# EAGLE design Esquematico (EAGLE 7.7.0)

## Sheet 1 of 2
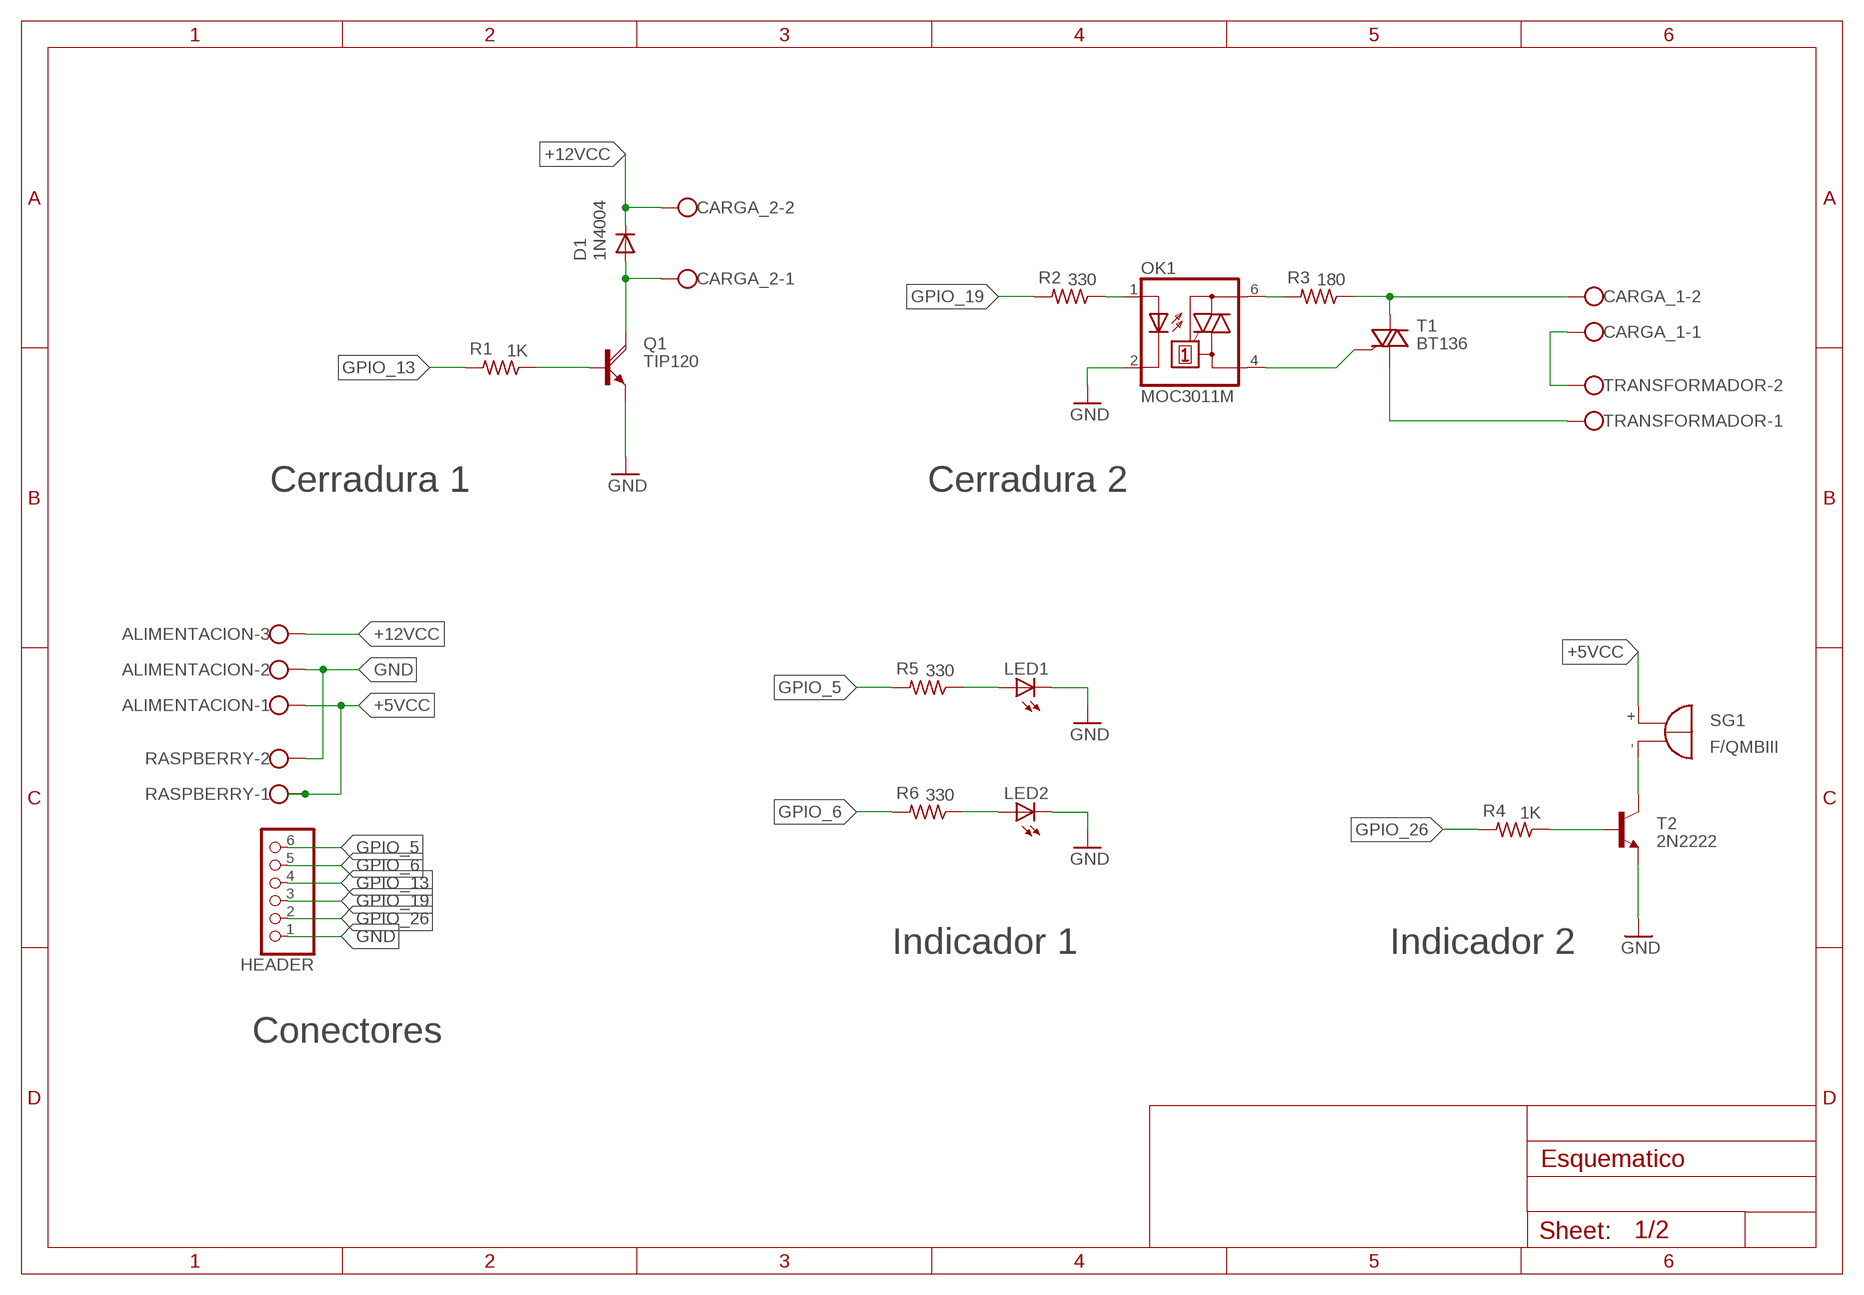
[diagram p0: schematic, sheet 1]

### Parts
ALIMENTACION  W237-103  [W237-103]
CARGA_1  W237-102  [W237-102]
CARGA_2  W237-102  [W237-102]
D1  1N4004  [DO41-10]
HEADER  PINHD-1X6B  [1X06-BIG]
LED1  LED5MM  [LED5MM]
LED2  LED5MM  [LED5MM]
OK1  MOC3011M  [DIL06]
Q1  TIP120  [TO220AH]
R1  1K  R-US_0207/10  [0207/10]
R2  330  R-US_0207/10  [0207/10]
R3  180  R-US_0207/10  [0207/10]
R4  1K  R-US_0207/10  [0207/10]
R5  330  R-US_0207/10  [0207/10]
R6  330  R-US_0207/10  [0207/10]
RASPBERRY  W237-102  [W237-102]
SG1  F/QMBIII  [F/QMBIII]
T1  BT136  [TO220AB]
T2  2N2222  [TO92-EBC-OVAL]
TRANSFORMADOR  W237-102  [W237-102]

### Nets
+5VCC: ALIMENTACION.1 RASPBERRY.1 SG1.+(-)
+12VCC: ALIMENTACION.3 CARGA_2.2 D1.C
CARGA_2: CARGA_2.1 D1.A Q1.C
GND: ALIMENTACION.2 HEADER.1 LED1.K(C) LED2.K(C) OK1.2(C) Q1.E RASPBERRY.2 T2.E
GPIO_5: HEADER.6 R5.2
GPIO_6: HEADER.5 R6.2
GPIO_13: HEADER.4 R1.2
GPIO_19: HEADER.3 R2.2
GPIO_26: HEADER.2 R4.2
N$1: LED1.A R5.1
N$2: Q1.B R1.1
N$3: SG1.-(+) T2.C
N$4: OK1.1(A) R2.1
N$5: OK1.6(A2) R3.2
N$6: CARGA_1.2 R3.1 T1.2(A2)
N$7: OK1.4(A1) T1.3(G)
N$8: LED2.A R6.1
N$11: CARGA_1.1 TRANSFORMADOR.2
N$12: T1.1(A1) TRANSFORMADOR.1
N$14: R4.1 T2.B

### Notes on the sheet
- Cerradura 1 | Cerradura 2
- Indicador 1 | Indicador 2
- Conectores

## Sheet 2 of 2
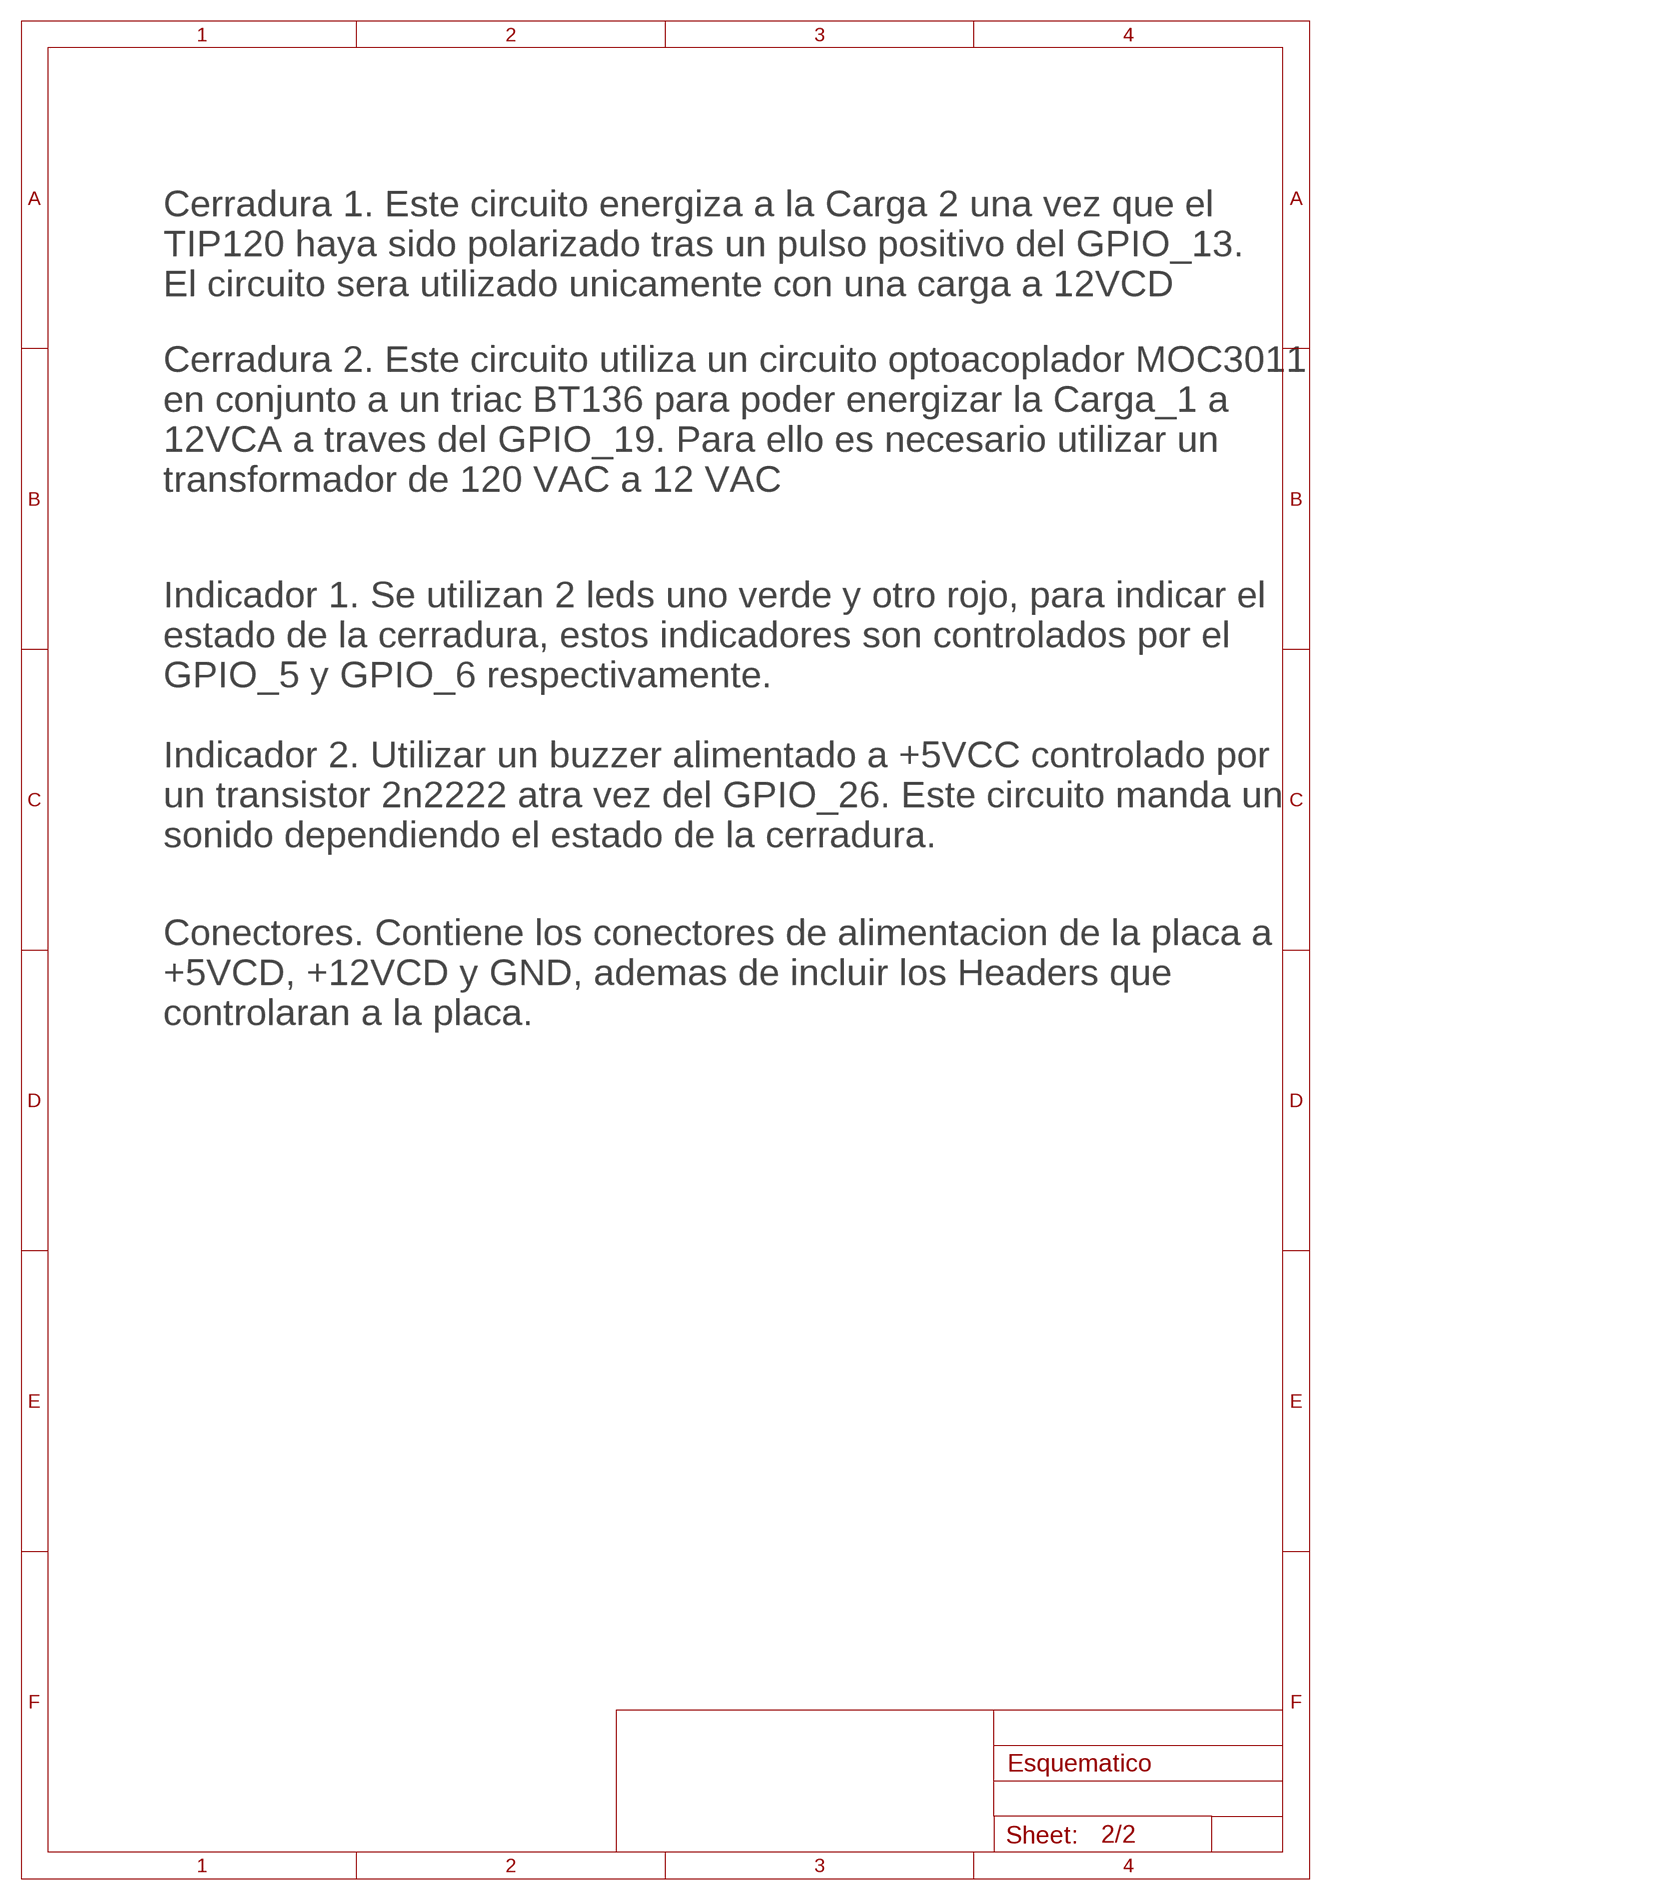
[diagram p1: schematic, sheet 2]

### Notes on the sheet
- Cerradura 1. Este circuito energiza a la Carga 2 una vez que el 
  TIP120 haya sido polarizado tras un pulso positivo del GPIO_13.
  El circuito sera utilizado unicamente con una carga a 12VCD
- Cerradura 2. Este circuito utiliza un circuito optoacoplador MOC3011 
  en conjunto a un triac BT136 para poder energizar la Carga_1 a
  12VCA a traves del GPIO_19. Para ello es necesario utilizar un 
  transformador de 120 VAC a 12 VAC
- Indicador 1. Se utilizan 2 leds uno verde y otro rojo, para indicar el 
  estado de la cerradura, estos indicadores son controlados por el 
  GPIO_5 y GPIO_6 respectivamente.
- Indicador 2. Utilizar un buzzer alimentado a +5VCC controlado por
  un transistor 2n2222 atra vez del GPIO_26. Este circuito manda un
  sonido dependiendo el estado de la cerradura.
- Conectores. Contiene los conectores de alimentacion de la placa a 
  +5VCD, +12VCD y GND, ademas de incluir los Headers que
  controlaran a la placa.

## Library data of the parts
ALIMENTACION = con-wago-500:W237-103: WAGO SCREW CLAMP; MPN: 237-103; OC_FARNELL: unknown; OC_NEWARK: 18M7116
CARGA_1 CARGA_2 RASPBERRY TRANSFORMADOR = con-wago-500:W237-102: WAGO SCREW CLAMP; MPN: 237-102; OC_FARNELL: unknown; OC_NEWARK: 70K9898
D1 = diode:1N4004: DIODE general purpose rectifier, 1 A
HEADER = adafruit:PINHD-1X6: PIN HEADER
LED1 LED2 = adafruit:LED: LED OSRAM: - CHIPLED LG R971, LG N971, LY N971, LG Q971, LY Q971, LO R971, LY R971 LH N974, LH R974 LS Q976, LO Q976, LY Q976 LO Q996 - Hyper CHIPLED LW Q18S LB Q993, LB Q99A, LB R99A - SideLED LS A670, LO A670, LY A670, LG A670, LP A670 LB A673, LV A673, LT A673, LW A673 LH A674 LY A675 LS A676, LA A676, LO A676, LY A676, LW A676 LS A679, LY A679, LG A679 - Hyper Micro SIDELED® LS Y876, LA Y876, LO Y876, LY Y876 LT Y87S - SmartLED LW L88C, LW L88S LB L89C, LB L89S, LG L890 LS L89K, LO L89K, LY L89K LS L896, LA L896, LO L896, LY L896 - TOPLED LS T670, LO T670, LY T670, LG T670, LP T670 LSG T670, LSP T670, LSY T670, LOP T670, LYG T670 LG T671, LOG T671, LSG T671 LB T673, LV T673, LT T673, LW T673 LH T674 LS T676, LA T676, LO T676, LY T676, LB T676, LH T676, LSB T676, LW T676 LB T67C, LV T67C, LT T67C, LS T67K, LO T67K, LY T67K, LW E67C LS E67B, LA E67B, LO E67B, LY E67B, LB E67C, LV E67C, LT E67C LW T67C LS T679, LY T679, LG T679 LS T770, LO T770, LY T770, LG T770, LP T770 LB T773, LV T773, LT T773, LW T773 LH T774 LS E675, LA E675, LY E675, LS T675 LS T776, LA T776, LO T776, LY T776, LB T776 LHGB T686 LT T68C, LB T68C - Hyper Mini TOPLED® LB M676 - Mini TOPLED Santana® LG M470 LS M47K, LO M47K, LY M47K Source: http://www.osram.convergy.de/
OK1 = optocoupler:MOC30*M: RANDOM-PHASE OPTOISOLATORS TRIAC DRIVER OUTPUT Source: http://www.fairchildsemi.com MOC3020-M.pdf; MF: FAIRCHILD SEMICONDUCTOR; MPN: MOC3011-M; OC_FARNELL: 1021363; OC_NEWARK: 72K8893
Q1 = transistor-power:TIP120: NPN DARLINGTON TRANSISTOR
R1-R6 = rcl:R-US_: RESISTOR, American symbol
SG1 = buzzer:F/QMBIII: BUZZER Source: Buerklin; OC_FARNELL: unknown; OC_NEWARK: unknown
T1 = Triacs:BT136: Triac BT136 series E sensitive gate Source: http://www.nxp.com/acrobat_download/datasheets/BT136_SERIES_E_2.pdf
T2 = adafruit:2N2222: NPN TRANSISTOR Big oval pads

## Board
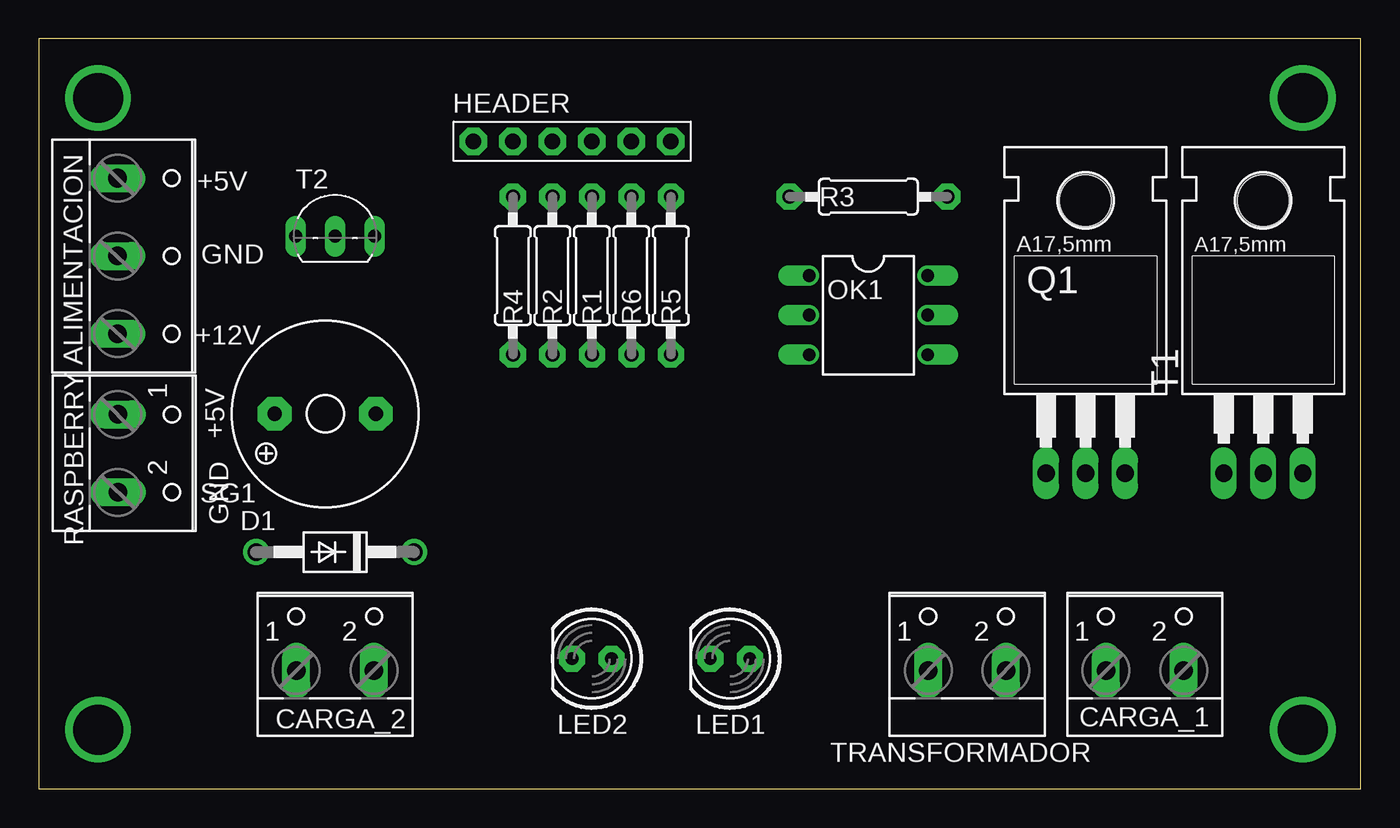
[diagram p2: board, top side]
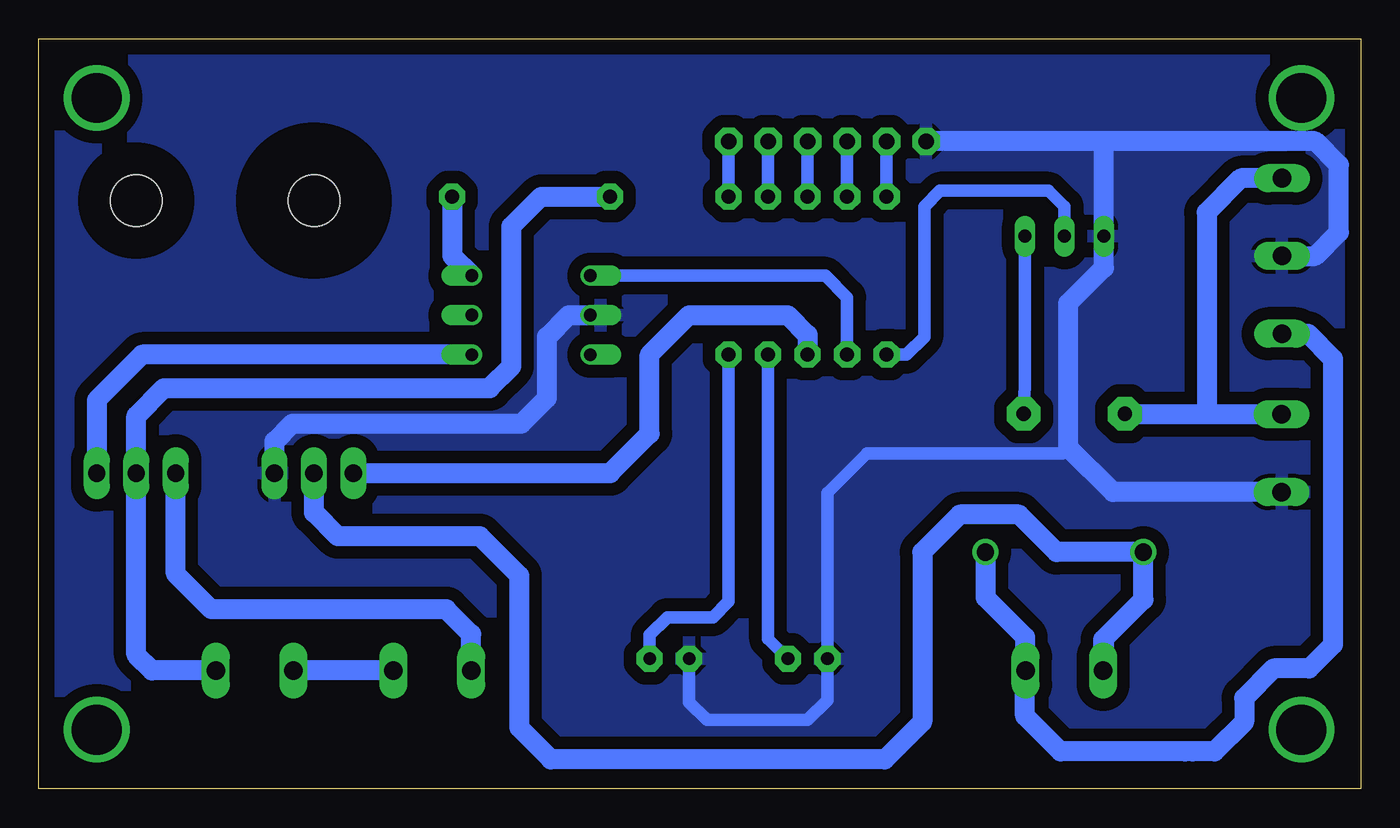
[diagram p3: board, bottom side, seen from below]

Size 85 x 48.25 mm. Coordinates in mm from the lower left corner, seen from the top.
Outline: 0,0 85,0 85,48.25 0,48.25 0,0
Copper layers (1*16): Top 0.035mm / dielectric 1.5mm / Bottom 0.035mm
Design rules "default": minimum track width 10mil, minimum drill 24mil, track to track 8mil, track to pad 8mil, pad to pad 8mil, via to via 8mil, smd to smd 8mil, copper to edge 40mil, drill to drill 8mil, minimum pad ring 10mil, minimum via ring 8mil, stop-mask expansion 4mil, vias tented up to drill 0mil, thermal gap 10mil

### Footprints (pad centres in the part's own frame; a part is rotated, then mirrored left to right if it is on the bottom)
W237-103 = drill 1.194 long: 1 -5,-1.29; 2 0,-1.29; 3 5,-1.29
W237-102 = drill 1.194 long: 1 -2.5,-1.27; 2 2.5,-1.27
DO41-10 = drill 1.118: A 5.08,0; C -5.08,0
1X06-BIG = drill 1.016 pad 1.778 octagon: 1 -6.35,0; 2 -3.81,0; 3 -1.27,0; 4 1.27,0; 5 3.81,0; 6 6.35,0
LED5MM = drill 0.813 pad 1.676 octagon: A -1.27,0; K 1.27,0
DIL06 = drill 0.813 offset: 1 -2.54,-3.81; 2 0,-3.81; 3 2.54,-3.81; 4 2.54,3.81; 5 0,3.81; 6 -2.54,3.81
TO220AH = drill 1.118 long: B -2.54,-6.35; C 0,-6.35; E 2.54,-6.35 | hole 3.302: 0,11.176
0207/10 = drill 0.9 pad 1.676 octagon: 1 -5.08,0; 2 5.08,0
F/QMBIII = drill 0.914 pad 2.159 octagon: + 3.251,0; - -3.251,0
TO220AB = drill 1.118 long: 1 -2.54,-6.35; 2 0,-6.35; 3 2.54,-6.35 | hole 3.302: 0,11.176
TO92-EBC-OVAL = drill 0.813 long: B 0,-1.27; C 2.54,-1.27; E -2.54,-1.27

### Placement (x,y rotation side)
ALIMENTACION  6.35,34.29 270 top
CARGA_1  71.12,8.89 0 top
CARGA_2  19.05,8.89 0 top
D1  19.05,15.24 180 top
HEADER  34.29,41.66 0 top
LED1  44.45,8.38 180 top
LED2  35.56,8.38 180 top
OK1  53.34,30.48 270 top
Q1  67.31,26.67 0 top
R1  [0207/10]  35.56,33.02 90 top
R2  [0207/10]  33.02,33.02 90 top
R3  [0207/10]  53.34,38.1 0 top
R4  [0207/10]  30.48,33.02 90 top
R5  [0207/10]  40.64,33.02 90 top
R6  [0207/10]  38.1,33.02 90 top
RASPBERRY  6.35,21.59 270 top
SG1  18.41,24.13 180 top
T1  78.74,26.67 0 top
T2  19.05,36.83 0 top
TRANSFORMADOR  59.69,8.89 0 top

### Tracks (layer width: path | path; a pad name or v marks a point on that pad's centre or on a via)
+5VCC
  Bottom 1.27: RASPBERRY.1 10.03,24.09 | 10.03,24.09 15.12,24.09 SG1.+ | ALIMENTACION.1 7.7,39.29 9.91,37.08 9.91,24.22 10.03,24.09
+12VCC
  Bottom 1.27: ALIMENTACION.3 3.38,29.29 1.78,27.69 1.78,9.27 3.3,7.75 5.59,7.75 7.49,5.84 7.49,4.32 9.4,2.41 10.79,2.41 11.3,2.41 19.3,2.41 21.59,4.7 21.59,7.58 CARGA_2.2 21.59,7.66 21.59,9.78 24.13,12.32 D1.C
CARGA_2
  Bottom 1.27: 16.51,9.65 16.51,7.66 CARGA_2.1 16.55,9.61 16.51,9.65 | 16.51,9.65 13.97,12.19 D1.A 19.56,15.24 21.97,17.65 25.78,17.65 28.19,15.24 28.19,4.32 30.61,1.9 52.07,1.9 54.1,3.94 54.1,13.72 56.64,16.26 65.79,16.26 67.31,17.78 Q1.C
GND
  Bottom 0.813: 18.8,21.97 19.18,21.59 31.75,21.59 34.29,19.05 LED2.K 34.29,5.71 35.56,4.45 42.04,4.45 43.18,5.59 LED1.K
  Bottom 1.27: RASPBERRY.2 15.91,19.09 18.8,21.97 18.8,31.24 16.51,33.53 T2.E 16.51,41.66 | ALIMENTACION.2 2.92,34.29 1.4,35.81 1.4,40.13 2.92,41.66 16.51,41.66 | 16.51,41.66 HEADER.1 | Q1.E 69.85,22.35 68.71,23.49 53.98,23.49 52.32,25.15 52.32,29.08 50.93,30.48 OK1.2
  pour Bottom (isolate 0.813): 0,48.26 85.09,48.26 85.09,0 0,0
GPIO_5
  Bottom 0.813: HEADER.6 R5.2
GPIO_6
  Bottom 0.813: HEADER.5 R6.2
GPIO_13
  Bottom 0.813: HEADER.4 R1.2
GPIO_19
  Bottom 0.813: HEADER.3 R2.2
GPIO_26
  Bottom 0.813: HEADER.2 R4.2
N$1
  Bottom 0.813: R5.1 40.64,12.06 41.66,11.05 44.58,11.05 45.72,9.91 LED1.A
N$2
  Bottom 1.27: Q1.B 48.26,20.32 45.72,22.86 45.72,27.94 43.18,30.48 36.83,30.48 35.56,29.21 R1.1
N$3
  Bottom 0.813: T2.C 21.59,26.11 SG1.-
N$4
  Bottom 0.813: R2.1 33.02,31.62 34.42,33.02 OK1.1
N$5
  Bottom 1.27: R3.2 58.42,34.29 OK1.6
N$6
  Bottom 1.27: CARGA_1.2 77.72,7.62 78.74,8.64 T1.2 78.74,24 76.96,25.78 56.01,25.78 54.61,27.18 54.61,36.2 52.7,38.1 R3.1
N$7
  Bottom 1.27: OK1.4 78.36,27.94 81.28,25.02 T1.3
N$8
  Bottom 0.813: R6.1 38.1,9.65 LED2.A
N$10  (via drill 3.2 pad 3.81)
  other vias: 81.28,44.45
N$11
  Bottom 1.27: TRANSFORMADOR.2 CARGA_1.1
N$12
  Bottom 1.27: TRANSFORMADOR.1 57.19,9.95 58.8,11.56 73.91,11.56 76.2,13.84 T1.1
N$13  (via drill 3.2 pad 3.81)
  other vias: 3.81,44.45
N$14
  Bottom 0.813: T2.B 19.05,37.46 20.07,38.48 27.05,38.48 28.07,37.46 28.07,29.08 29.21,27.94 R4.1
N$15  (via drill 3.2 pad 3.81)
  other vias: 3.81,3.81
N$16  (via drill 3.2 pad 3.81)
  other vias: 81.28,3.81

### Text on the board
tNames: +5V | GND | +12V | +5V | GND